# EAGLE design M697D (EAGLE 6.6.0)
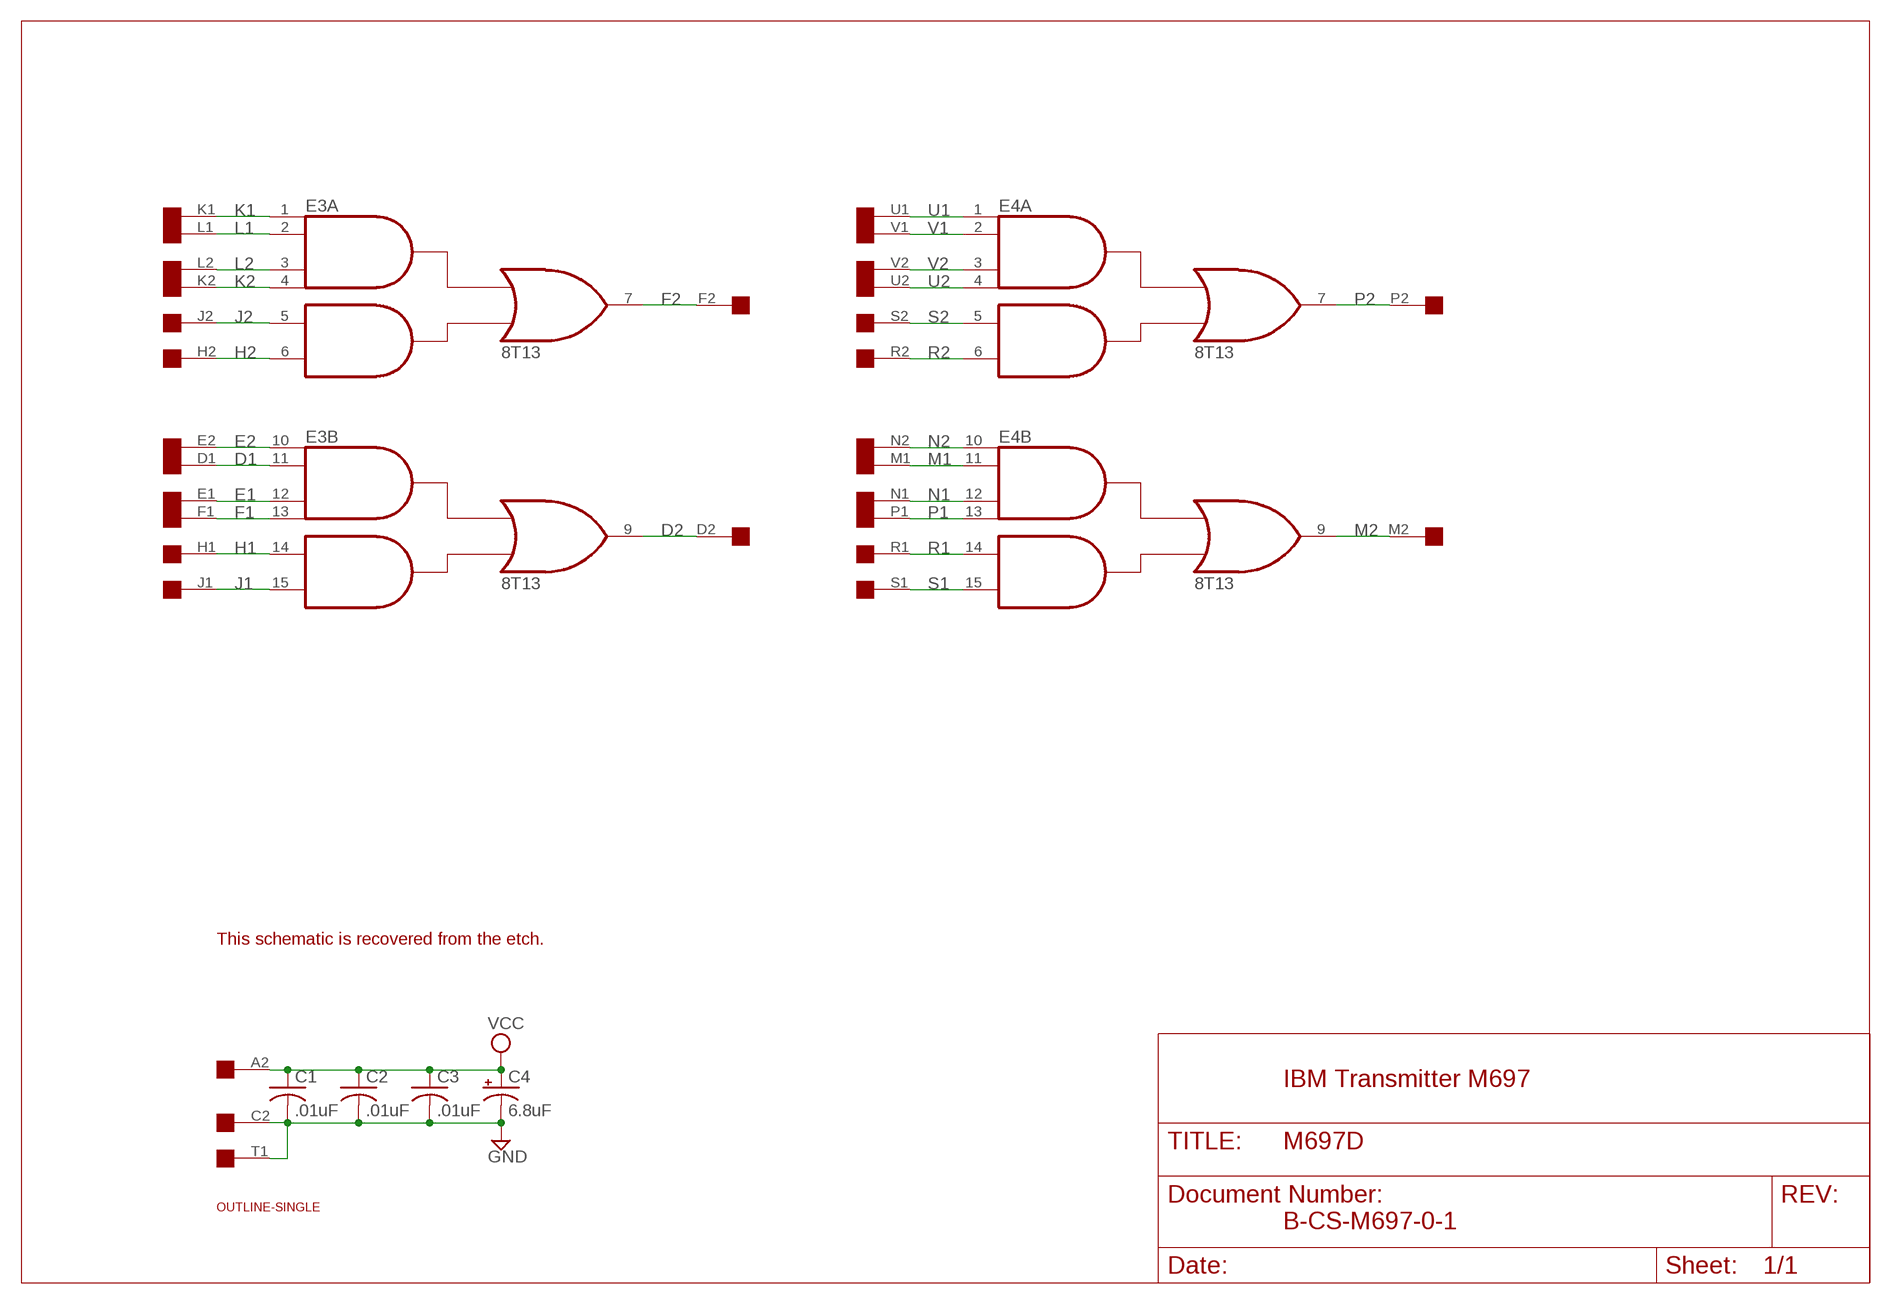
[diagram p0: schematic, sheet 1]

## Parts
C1  .01uF  C-US050-025X075  [C050-025X075]
C2  .01uF  C-US050-025X075  [C050-025X075]
C3  .01uF  C-US050-025X075  [C050-025X075]
C4  6.8uF  CPOL-USE20-8AXIAL  [E12-8]
E3  8T13  [DIL16]
E4  8T13  [DIL16]
U$2  SINGLE  [EDGE-CON2]
U$4  OUTLINE-SINGLE  [SINGLE]

## Nets
D1: E3.11(B:A2) U$2.D1
D2: E3.9(B:O) U$2.D2
E1: E3.12(B:A3) U$2.E1
E2: E3.10(B:A1) U$2.E2
F1: E3.13(B:A4) U$2.F1
F2: E3.7(A:O) U$2.F2
GND [Supply]: C1.2 C2.2 C3.2 C4.- U$2.C2 U$2.T1
H1: E3.14(B:B1) U$2.H1
H2: E3.6(A:B2) U$2.H2
J1: E3.15(B:B2) U$2.J1
J2: E3.5(A:B1) U$2.J2
K1: E3.1(A:A1) U$2.K1
K2: E3.4(A:A4) U$2.K2
L1: E3.2(A:A2) U$2.L1
L2: E3.3(A:A3) U$2.L2
M1: E4.11(B:A2) U$2.M1
M2: E4.9(B:O) U$2.M2
N1: E4.12(B:A3) U$2.N1
N2: E4.10(B:A1) U$2.N2
P1: E4.13(B:A4) U$2.P1
P2: E4.7(A:O) U$2.P2
R1: E4.14(B:B1) U$2.R1
R2: E4.6(A:B2) U$2.R2
S1: E4.15(B:B2) U$2.S1
S2: E4.5(A:B1) U$2.S2
U1: E4.1(A:A1) U$2.U1
U2: E4.4(A:A4) U$2.U2
V1: E4.2(A:A2) U$2.V1
V2: E4.3(A:A3) U$2.V2
VCC [Supply]: C1.1 C2.1 C3.1 C4.+ U$2.A2
Unconnected: U$2.A1 U$2.B1 U$2.B2 U$2.C1 U$2.T2

## Notes on the sheet
- This schematic is recovered from the etch.
- IBM Transmitter M697
- B-CS-M697-0-1

## Power pins joined to a net without a drawn wire
GND: E3.8(P:GND) E4.8(P:GND)
VCC: E3.16(P:VCC) E4.16(P:VCC)

## Library data of the parts
C1-C3 = rcl:C-US: CAPACITOR, American symbol
C4 = dec-con:CPOL-USE20-8AXIAL: A 0.8 inch electrolytic.
E3 E4 = dec-con:8T13: Dual IBM Transmitter
U$2 = dec-con:SINGLE: Single-Height DEC board
U$4 = dec-con:OUTLINE-*: Board outlines for DEC boards.

## Net classes
1 Supply: width 0.813 mm

## Board
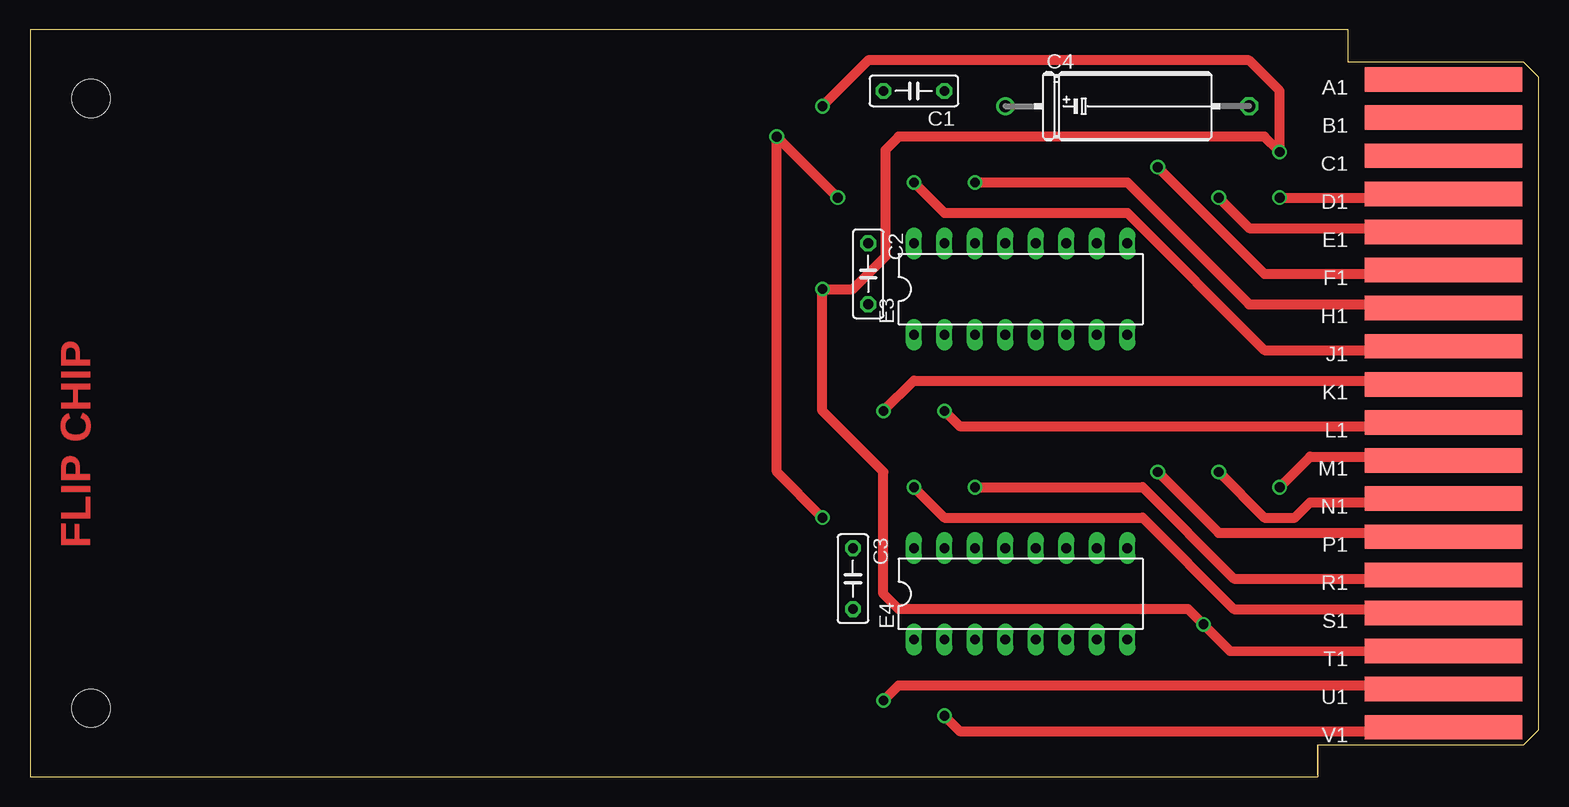
[diagram p1: board, top side]
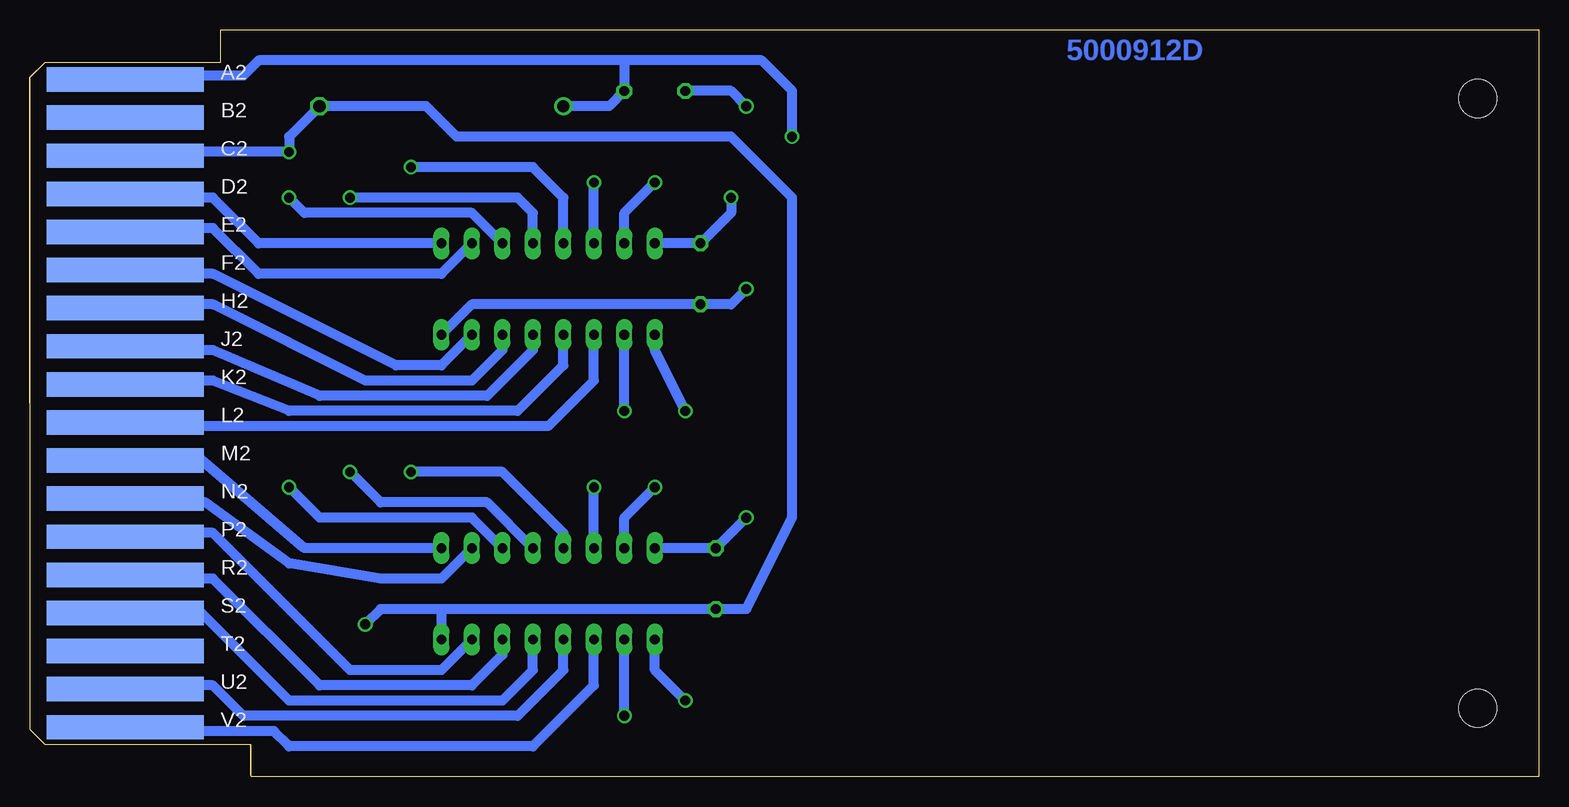
[diagram p2: board, bottom side, seen from below]

Size 125.73 x 62.23 mm. Coordinates in mm from the lower left corner, seen from the top.
Copper layers (1+16): Top 0.035mm / dielectric 1.5mm / Bottom 0.035mm
Design rules "16mils": minimum track width 16mil, minimum drill 32mil, track to track 15mil, track to pad 10mil, pad to pad 10mil, via to via 10mil, smd to smd 10mil, copper to edge 13mil, drill to drill 10mil, minimum pad ring 10mil, minimum via ring 8mil, stop-mask expansion 0mil, vias tented up to drill 0mil, thermal gap 10mil

### Footprints (pad centres in the part's own frame; a part is rotated, then mirrored left to right if it is on the bottom)
C050-025X075 = drill 0.813 octagon: 1 -2.54,0; 2 2.54,0
E12-8 = drill 1.016: + -10.16,0 | drill 1.016 octagon: - 10.16,0
DIL16 = drill 0.813 long: 1 -8.89,-3.81; 2 -6.35,-3.81; 3 -3.81,-3.81; 4 -1.27,-3.81; 5 1.27,-3.81; 6 3.81,-3.81; 7 6.35,-3.81; 8 8.89,-3.81; 9 8.89,3.81; 10 6.35,3.81; 11 3.81,3.81; 12 1.27,3.81; 13 -1.27,3.81; 14 -3.81,3.81; 15 -6.35,3.81; 16 -8.89,3.81
EDGE-CON2 = smd 13.106 x 2.032: A1 7.938,4.128; B1 7.938,7.303; C1 7.938,10.477; D1 7.938,13.652; E1 7.938,16.828; F1 7.938,20.003; H1 7.938,23.177; J1 7.938,26.352; K1 7.938,29.527; L1 7.938,32.703; M1 7.938,35.877; N1 7.938,39.053; P1 7.938,42.227; R1 7.938,45.403; S1 7.938,48.578; T1 7.938,51.752; U1 7.938,54.928; V1 7.938,58.102 | smd 13.106 x 2.032 bottom: A2 7.938,4.128; B2 7.938,7.303; C2 7.938,10.477; D2 7.938,13.652; E2 7.938,16.828; F2 7.938,20.003; H2 7.938,23.177; J2 7.938,26.352; K2 7.938,29.527; L2 7.938,32.703; M2 7.938,35.877; N2 7.938,39.053; P2 7.938,42.227; R2 7.938,45.403; S2 7.938,48.578; T2 7.938,51.752; U2 7.938,54.928; V2 7.938,58.102
SINGLE = hole 3.175: 120.65,56.515; 120.65,5.715

### Placement (x,y rotation side)
C1  73.66,57.15 180 top
C2  69.85,41.91 270 top
C3  68.58,16.51 270 top
C4  91.44,55.88 0 top
E3  82.55,40.64 0 top
E4  82.55,15.24 0 top
U$1  [FLIPCHIP]  0,0 0 top
U$2  125.73,62.23 180 top
U$4  125.73,62.23 180 top

### Tracks (layer width: path | path; a pad name or v marks a point on that pad's centre or on a via)
D1  (via drill 0.81)
  Top 0.813: U$2.D1 117.14,48.56 116.84,48.26 v104.14,48.26
  Bottom 0.813: E3.11 88.9,46.99 102.87,46.99 v104.14,48.26
D2
  Bottom 0.813: E3.9 106.68,44.45 110.49,48.26 116.84,48.26 117.14,48.56 U$2.D2
E1  (via drill 0.81)
  Top 0.813: U$2.E1 117.17,45.39 116.84,45.72 101.6,45.72 v99.06,48.26
  Bottom 0.813: E3.12 83.82,46.99 85.09,48.26 v99.06,48.26
E2
  Bottom 0.813: E3.10 91.44,41.91 106.68,41.91 110.49,45.72 116.84,45.72 117.17,45.39 U$2.E2
F1  (via drill 0.81)
  Top 0.813: U$2.F1 117.12,42.19 116.84,41.91 102.87,41.91 v93.98,50.8
  Bottom 0.813: E3.13 81.28,48.26 83.82,50.8 v93.98,50.8
F2
  Bottom 0.813: E3.7 91.44,34.29 95.25,34.29 110.49,41.91 116.84,41.91 117.12,42.19 U$2.F2
GND  (via drill 0.81)
  Top 0.813: v66.04,55.88 69.85,59.69 101.6,59.69 104.14,57.15 v104.14,52.07 102.87,53.34 72.39,53.34 71.28,52.23 71.28,43.34 68.58,40.64 v66.04,40.64 66.04,30.48 71.12,25.4 71.12,15.24 72.39,13.97 96.52,13.97 v97.79,12.7 100,10.49 U$2.T1
  Bottom 0.813: U$2.C2 117.17,51.74 116.84,52.07 v104.14,52.07 104.14,53.34 C4.- 92.71,55.88 90.17,53.34 67.31,53.34 62.23,48.26 62.23,21.59 66.04,13.97 C3.2 91.44,13.97 | C1.2 67.31,57.15 v66.04,55.88 | 91.44,13.97 E4.8 | E3.8 88.9,39.37 C2.2 67.31,39.37 v66.04,40.64 | v97.79,12.7 96.52,13.97 91.44,13.97
H1  (via drill 0.81)
  Top 0.813: U$2.H1 117.17,39.04 116.84,39.37 101.6,39.37 91.44,49.53 v78.74,49.53
  Bottom 0.813: E3.14 v78.74,49.53
H2
  Bottom 0.813: E3.6 86.36,35.56 88.9,33.02 97.79,33.02 110.49,39.37 116.84,39.37 117.17,39.04 U$2.H2
J1  (via drill 0.81)
  Top 0.813: U$2.J1 117.17,35.89 116.84,35.56 102.87,35.56 91.44,46.99 76.2,46.99 v73.66,49.53
  Bottom 0.813: E3.15 76.2,46.99 v73.66,49.53
J2
  Bottom 0.813: E3.5 83.82,35.56 87.63,31.75 101.6,31.75 110.49,35.56 116.84,35.56 117.17,35.89 U$2.J2
K1  (via drill 0.81)
  Top 0.813: U$2.K1 117.14,32.72 116.84,33.02 73.66,33.02 v71.12,30.48
  Bottom 0.813: E3.1 73.66,35.56 v71.12,30.48
K2
  Bottom 0.813: E3.4 81.28,34.29 85.09,30.48 104.14,30.48 110.49,33.02 116.84,33.02 117.14,32.72 U$2.K2
L1  (via drill 0.81)
  Top 0.813: U$2.L1 117.17,29.54 116.84,29.21 77.47,29.21 v76.2,30.48
  Bottom 0.813: v76.2,30.48 E3.2
L2
  Bottom 0.813: E3.3 78.74,33.02 82.55,29.21 116.84,29.21 117.17,29.54 U$2.L2
M1  (via drill 0.81)
  Top 0.813: U$2.M1 117.17,26.34 116.84,26.67 106.68,26.67 v104.14,24.13
  Bottom 0.813: E4.11 88.9,21.59 101.6,21.59 v104.14,24.13
M2
  Bottom 0.813: E4.9 102.87,19.05 111.76,26.67 116.84,26.67 117.17,26.34 U$2.M2
N1  (via drill 0.81)
  Top 0.813: U$2.N1 117.17,23.19 116.84,22.86 106.68,22.86 105.41,21.59 102.87,21.59 v99.06,25.4
  Bottom 0.813: E4.12 87.63,22.86 96.52,22.86 v99.06,25.4
N2
  Bottom 0.813: E4.10 91.44,16.51 96.52,16.51 104.14,17.78 111.12,22.86 116.84,22.86 117.17,23.19 U$2.N2
P1  (via drill 0.81)
  Top 0.813: U$2.P1 117.17,19.99 116.84,20.32 99.06,20.32 v93.98,25.4
  Bottom 0.813: E4.13 81.28,20.32 86.36,25.4 v93.98,25.4
P2
  Bottom 0.813: E4.7 91.44,8.89 99.06,8.89 110.49,20.32 116.84,20.32 117.17,19.99 U$2.P2
R1  (via drill 0.81)
  Top 0.813: U$2.R1 117.17,16.84 116.84,16.51 100.33,16.51 92.71,24.13 v78.74,24.13
  Bottom 0.813: E4.14 v78.74,24.13
R2
  Bottom 0.813: E4.6 86.36,10.16 88.9,7.62 101.6,7.62 110.49,16.51 116.84,16.51 117.17,16.84 U$2.R2
S1  (via drill 0.81)
  Top 0.813: U$2.S1 117.14,13.66 116.84,13.97 100.33,13.97 92.71,21.59 76.2,21.59 v73.66,24.13
  Bottom 0.813: E4.15 76.2,21.59 v73.66,24.13
S2
  Bottom 0.813: E4.5 83.82,8.89 86.36,6.35 104.14,6.35 111.76,13.97 116.84,13.97 117.14,13.66 U$2.S2
U1  (via drill 0.81)
  Top 0.813: U$2.U1 117.2,7.26 116.84,7.62 72.39,7.62 v71.12,6.35
  Bottom 0.813: E4.1 73.66,8.89 v71.12,6.35
U2
  Bottom 0.813: E4.4 81.28,8.89 85.09,5.08 107.95,5.08 110.49,7.62 116.84,7.62 117.2,7.26 U$2.U2
V1  (via drill 0.81)
  Top 0.813: U$2.V1 117.23,4.2 116.84,3.81 77.47,3.81 v76.2,5.08
  Bottom 0.813: v76.2,5.08 E4.2
V2
  Bottom 0.813: E4.3 78.74,7.62 83.82,2.54 104.14,2.54 105.41,3.81 116.84,3.81 117.23,4.2 U$2.V2
VCC  (via drill 0.81)
  Top 0.813: v67.31,48.26 v62.23,53.34 62.23,25.4 v66.04,21.59
  Bottom 0.813: U$2.A2 117.24,58.02 116.84,58.42 107.95,58.42 106.68,59.69 76.2,59.69 | 76.2,59.69 64.77,59.69 62.23,57.15 v62.23,53.34 | 76.2,59.69 C1.1 77.47,55.88 C4.+ | v67.31,48.26 67.31,46.99 C2.1 E3.16 | E4.16 C3.1 v66.04,21.59

### Text on the board
Bottom: 5000912D